# Altium schematic sheet USB-C_Serial_16U2.SchDoc: USB-C_Serial_16U2
size A4; Author: Giuseppe Pinto; CompanyName: Arduino; DrawnBy: Giuseppe Pinto; Engineer: Giuseppe Pinto; DocumentNumber: ABX_00068; Revision: V 1.0; SheetNumber: 1; SheetTotal: 1; RevAuthor: Giuseppe Pinto
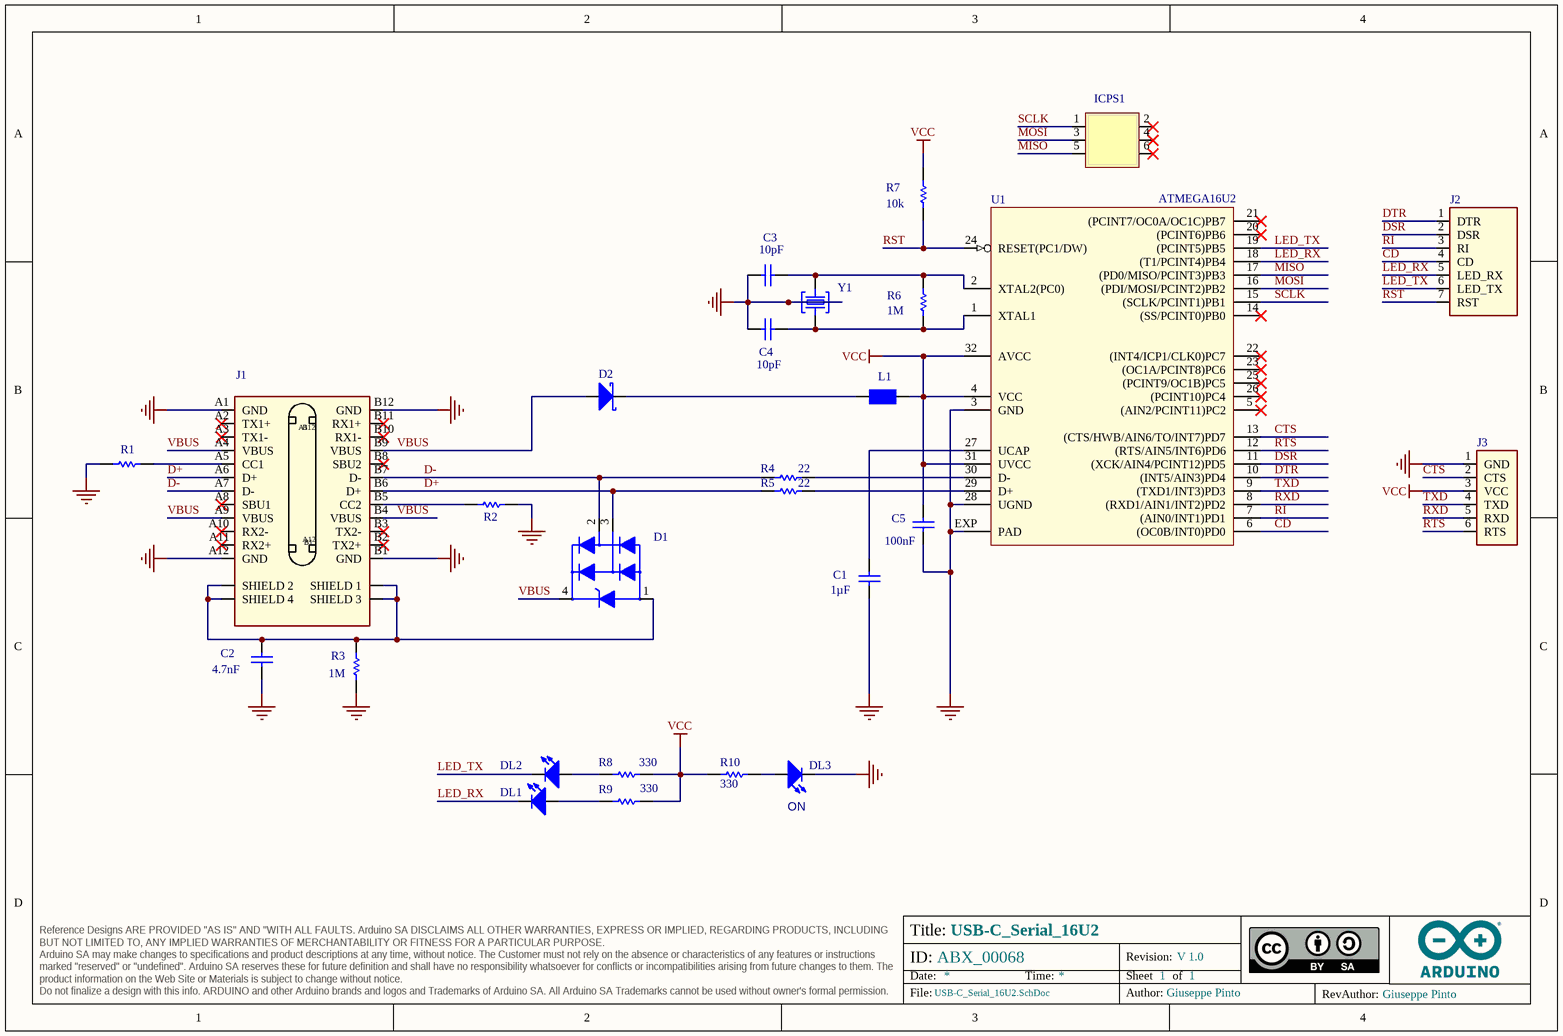
[diagram p0: USB-C_Serial_16U2.SchDoc]

## Parts
C1  value 1µF  [CAP-0402]  (hidden comment: C0402C105K8PACTU)
C2  value 4.7nF  [CAP-0805]  (hidden comment: C0805C472KDRACTU)
C3  value 10pF  [CAP-0402]  (hidden comment: C0402H100J5GACTU)
C4  value 10pF  [CAP-0402]  (hidden comment: C0402H100J5GACTU)
C5  value 100nF  [CAP-0402]  (hidden comment: C0402C104K4RACTU)
D1  PRTR5V0U2X,215  [SOT190P230X110-4N]  (value not drawn)
D2  PMEG6020AELRX  [SOD123-1]  (value not drawn)
DL1  HSMD-C190  [LEDC1608X80N-AK]  (value not drawn)
DL2  HSMD-C190  [LEDC1608X80N-AK]  (value not drawn)
DL3  HSMG-C190  [LEDC1608X80N-AK]  (value not drawn)
ICPS1  PINHD-2X03-SM-TP  [2X03-TP]  (value not drawn)  (no BOM)
J1  12401598E4#2A  [12401598E4#2A]  (value not drawn)
J2  PH1-07-UA  [CONN STRIP 2.54 PIN HEADER DIP 180° 1x 7 PIN GOLD FLASH castelleted]  (value not drawn)
J3  PH1-06-UA  [CONN STRP 2.54 PIN HEADER DIP 180° 1x X PIN GOLD FLASH]  (value not drawn)
L1  BLM18PG471SN1D  [L-0603]  (value not drawn)
R1  RC0402FR-075K1L  [RES-0402]  (value not drawn)
R2  RC0402FR-075K1L  [RES-0402]  (value not drawn)
R3  value 1M  [RES-0402]  (hidden comment: CRCW04021M00FKED)
R4  value 22  [RES-0402]  (hidden comment: CRCW040222R0JNEDC)
R5  value 22  [RES-0402]  (hidden comment: CRCW040222R0JNEDC)
R6  value 1M  [RES-0402]  (hidden comment: CRCW04021M00FKED)
R7  value 10k  [RES-0402]  (hidden comment: CRCW040210K0FKED)
R8  value 330  [RES-0402]  (hidden comment: CRCW0402330RJNED)
R9  value 330  [RES-0402]  (hidden comment: CRCW0402330RJNED)
R10  value 330  [RES-0402]  (hidden comment: CRCW0402330RJNED)
U1  ATMEGA16U2  [ATMEL_QFN32]
Y1  FTX16.000M12SM3S-30/30  [CX3225SB16000D0GZJC1-Footprint-1]  (value not drawn)

## Nets
GND: C1.2 C2.1 C3.1 C4.1 C5.1 DL3.C J1.A1(GND) J1.A12(GND) J1.B1(GND) J1.B12(GND) J3.1(GND) R1.1 R2.2 R3.1 U1.3(GND) U1.28(UGND) U1.EXP(PAD) Y1.2 Y1.4
VCC: C5.2 J3.3(VCC) L1.2 R7.2 R8.1 R9.2 R10.2 U1.4(VCC) U1.31(UVCC) U1.32(AVCC)
CD: J2.4(CD) U1.6((OC0B/INT0)PD0)
CTS: J3.2(CTS) U1.13((CTS/HWB/AIN6/TO/INT7)PD7)
D+: D1.3 J1.A6(D+) J1.B6(D+) R5.1
D-: D1.2 J1.A7(D-) J1.B7(D-) R4.1
DSR: J2.2(DSR) U1.11((XCK/AIN4/PCINT12)PD5)
DTR: J2.1(DTR) U1.10((INT5/AIN3)PD4)
LED_RX: DL1.C J2.5(LED_RX) U1.18((T1/PCINT4)PB4)
LED_TX: DL2.C J2.6(LED_TX) U1.19((PCINT5)PB5)
MISO: ICPS1.5 U1.17((PD0/MISO/PCINT3)PB3)
MOSI: ICPS1.3 U1.16((PDI/MOSI/PCINT2)PB2)
RI: J2.3(RI) U1.7((AIN0/INT1)PD1)
RST: J2.7(RST) R7.1 U1.24(RESET(PC1/DW))
RTS: J3.6(RTS) U1.12((RTS/AIN5/INT6)PD6)
RXD: J3.5(RXD) U1.8((RXD1/AIN1/INT2)PD2)
SCLK: ICPS1.1 U1.15((SCLK/PCINT1)PB1)
TXD: J3.4(TXD) U1.9((TXD1/INT3)PD3)
VBUS: D1.4 D2.A J1.A4(VBUS) J1.A9(VBUS) J1.B4(VBUS) J1.B9(VBUS)
NetC1_1: C1.1 U1.27(UCAP)
NetC2_2: C2.2 D1.1 J1.SHIELD_1 J1.SHIELD_2 J1.SHIELD_3 J1.SHIELD_4 R3.2
NetC3_2: C3.2 R6.2 U1.2(XTAL2(PC0)) Y1.3
NetC4_2: C4.2 R6.1 U1.1(XTAL1) Y1.1
NetD2_C: D2.C L1.1
NetDL1_A: DL1.A R9.1
NetDL2_A: DL2.A R8.2
NetDL3_A: DL3.A R10.1
NetJ1_A5: J1.A5(CC1) R1.2
NetJ1_B5: J1.B5(CC2) R2.1
NetR4_2: R4.2 U1.30(D-)
NetR5_2: R5.2 U1.29(D+)

Not connected (* = marked no-connect by the designer): ICPS1 2* 4* 6*; J1 A2(TX1+)* A3(TX1-)* A8(SBU1)* A10(RX2-)* A11(RX2+)* B2(TX2+)* B3(TX2-)* B8(SBU2)* B10(RX1-)* B11(RX1+)*; U1 5((AIN2/PCINT11)PC2)* 14((SS/PCINT0)PB0)* 20((PCINT6)PB6)* 21((PCINT7/OC0A/OC1C)PB7)* 22((INT4/ICP1/CLK0)PC7)* 23((OC1A/PCINT8)PC6)* 25((PCINT9/OC1B)PC5)* 26((PCINT10)PC4)*

## Notes on the sheet
- (near DL3) ON
- Title:
- ID:
- Date:
- Time:
- Revision:
- Sheet
- of
- RevAuthor:
- Reference Designs ARE PROVIDED "AS IS" AND "WITH ALL FAULTS. Arduino SA DISCLAIMS ALL OTHER WARRANTIES, EXPRESS OR IMPLIED, REGARDING PRODUCTS, INCLUDING BUT NOT LIMITED TO, ANY IMPLIED WARRANTIES OF MERCHANTABILITY OR FITNESS FOR A PARTICULAR PURPOSE.
  Arduino SA may make changes to specifications and product descriptions at any time, without notice. The Customer must not rely on the absence or characteristics of any features or instructions marked "reserved" or "undefined". Arduino SA reserves these for future definition and shall have no responsibility whatsoever for conflicts or incompatibilities arising from future changes to them. The product information on the Web Site or Materials is subject to change without notice.
  Do not finalize a design with this info. ARDUINO and other Arduino brands and logos and Trademarks of Arduino SA. All Arduino SA Trademarks cannot be used without owner's formal permission.
- File:
- Author:

## Library data of the parts
C1 = C0017-A.9: CAP CHIP 0402 1uF 10V X5R 10%; Manufacturer: KEMET; Code Arduino: 0133; Package: 0402; Case Code (Imperial): 0402; Voltage: 10V; Case Code (Metric): 1005; Manufacturer Part Number 2: GRM155R61A105KE15D; Part Number: C0402C105K8PACTU; Tolerance: 10%; Dielectric: X5R; Case/Package: 0402; Manufacturer 2: AVX
C2 = C0059-A.9: CAP CHIP 0805 4.7nF 1000V X7R 10%; Manufacturer: KEMET; Voltage: 1kV; Code Arduino: 0689; Part Number: C0805C472KDRACTU; Dielectric: X7R; Package: 0805; Case/Package: 0805; Case Code (Metric): 2012; Tolerance: 10%; Case Code (Imperial): 0805
C3 C4 = C0006-A.9: CAP CHIP 0402 10pF 50V C0G 5%; Manufacturer: KEMET; Code Arduino: 3382; Dielectric: C0G; Manufacturer Part Number 2: 04025A100KAT2A; Case Code (Imperial): 0402; Part Number: C0402H100J5GACTU; Manufacturer 2: AVX; Case Code (Metric): 1005; Voltage: 50V; Package: 0402; Case/Package: 0402; Tolerance: 5%
C5 = C0012-A.10: CAP CHIP 0402 100nF 16V X7R 10%; Manufacturer: KEMET; Code Arduino: 0132; Manufacturer Part Number 2: 0402YC104KAT2A; Voltage: 16V; Part Number: C0402C104K4RACTU; Manufacturer 2: AVX; Case/Package: 0402; Package: 0402; Tolerance: 10%; Case Code (Metric): 1005; Dielectric: X7R; Case Code (Imperial): 0402
D1 = D0025-A.3: TVS ARRAY 4LIN.8kV 1pF SOT143B; Manufacturer: Nexperia; Code Arduino: 2209; Device Type: ESD protection; Part Number: PRTR5V0U2X,215
D2 = D0026-A.3: DIODE SCHOTTKY SMD 2A 60V SOD123FL; Manufacturer: Nexperia; Code Arduino: 2208; Forward Voltage: 0.6V; RoHS Compliance: RoHS3; Part Number: PMEG6020AELRX; Device Type: Diode Schottky; Forward Current: 2A
DL1 DL2 = L0007-A.6: LED SMD 0603 ORANGE604 8mcd DIFF.; Manufacturer: Broadcom; Code Arduino: 2207; Part Number: HSMD-C190; Pin Count: 2; Manufacturer 2: Kingbright; Manufacturer Part Number 2: KPT-1608SECK
DL3 = L0009-A.4: LED SMD 0603 GREEN/568 15mcd 120^; Manufacturer: Broadcom; Code Arduino: 2204; Part Number: HSMG-C190; Pin Count: 2
ICPS1 = J0066-A.3: 2X03 6 TEST POINTS; Code Arduino: DNP; Pin Count: 6; Part Number: PINHD-2X03-SM-TP
J1 = J0220-A.5: CONN RCP USB3.1 TYPEC 24P SMD RA; Manufacturer: Amphenol ICC (Commercial Products); Code Arduino: J0220; Number of Contacts: 24; Connector Type: TELECOM AND DATACOM CONNECTOR; Termination: SMD/SMT; REACH SVHC: No SVHC; Mount: Board; Contact Material: Copper Alloy; Manufacturer Part Number 2: 12401598E4#2A; Part Number: 12401598E4#2A; Flammability Rating: UL94 V-0
J2 = J0311-A.9: CONN STRIP 2.54 PIN HEADER DIP 180° 1x 7 PIN GOLD FLASH castelleted; Manufacturer: 4 UCONN; Number of Contacts: 7; Code Arduino: J0311; Number of Conductors: 7; Pin Count: 7; Number of Rows: 1; Number of Ports: 7; Part Number: PH1-07-UA
J3 = J0310-A.3: CONN STRP 2.54 PIN HEADER DIP 180° 1x6 PIN GOLD FLASH castellated; Manufacturer: 4UCONN; Code Arduino: J0310; Number of Conductors: 6; Number of Ports: 6; Pin Count: 6; Number of Rows: 1; Part Number: PH1-06-UA; Number of Contacts: 6
L1 = I0006-A.3: FERRITE SMD 0603 470R 1A 0.2R; Manufacturer: Murata; DC Resistance (DCR): 200mR; Tolerance: 25%; Impedance: 470µH; Code Arduino: 2200; Test Frequency: 100MHz; Part Number: BLM18PG471SN1D; Min Operating Temperature: -55°C; Packaging: Tape and Reel; Max DC Current: 1A; Max Operating Temperature: 125°C; Device Type: Ferrite; Case Code (Metric): 1608; Package Quantity: 1; Current: 1A; Case Code (Imperial): 0603
R1 R2 = R0210-A.6: RES CHIP 0402 5K1 1% 1/16W; Manufacturer: YAGEO; Code Arduino: R0210; Case/Package: 0402; Tolerance: 1%; Manufacturer Part Number 2: RC0402FR-075K1L; Part Number: RC0402FR-075K1L; Manufacturer 2: YAGEO
R3 R6 = R0058-A.5: RES CHIP 0402 1M 1% 1/16W; Manufacturer: Vishay; Power: 63mW; Code Arduino: 0139; Package: 0402; Case Code (Metric): 1005; Tolerance: 1%; Manufacturer 2: Panasonic; Case Code (Imperial): 0402; Manufacturer Part Number 2: ERJ-2RKF1004X; Part Number: CRCW04021M00FKED; Case/Package: 0402
R4 R5 = R0010-A.5: RES CHIP 0402 22R 5% 1/16W; Manufacturer: Vishay; Code Arduino: 0468; Power: 63mW; Manufacturer 2: Panasonic; Part Number: CRCW040222R0JNEDC; Case/Package: 0402; Case Code (Metric): 1005; Tolerance: 5%; Package: 0402; Case Code (Imperial): 0402; Manufacturer Part Number 2: ERJ-2GEJ220X
R7 = R0003-A.8: RES CHIP 0402 10K 1% 1/16W; Manufacturer: Vishay; Power: 63mW; Code Arduino: 0136; Manufacturer Part Number 2: ERJ-2RKF1002X; Package: 0402; Case Code (Imperial): 0402; Case Code (Metric): 1005; Part Number: CRCW040210K0FKED; Tolerance: 1%; Manufacturer 2: Panasonic; Case/Package: 0402
R8 R9 = R0017-A.8: RES CHIP 0402 330R 5% 1/16W; Manufacturer: Vishay; Power: 63mW; Code Arduino: 2229; Case Code (Imperial): 0402; Part Number: CRCW0402330RJNED; Tolerance: 5%; Case Code (Metric): 1005; Package: 0402; Case/Package: 0402; Manufacturer Part Number 2: ERJ-2GEJ331X; Manufacturer 2: Panasonic
R10 = R0017-A.5: RES CHIP 0402 330R 5% 1/16W; Manufacturer: Vishay; Power: 63mW; Code Arduino: 2229; Case Code (Imperial): 0402; Part Number: CRCW0402330RJNED; Tolerance: 5%; Case Code (Metric): 1005; Package: 0402; Case/Package: 0402; Manufacturer Part Number 2: ERJ-2GEJ331X; Manufacturer 2: Panasonic
U1 = U0035-A.7: IC ATMEGA16U2; Manufacturer: Microchip; Device Type: MCU; Part Number: ATMEGA16U2; Pin Count: 33; Code Arduino: ATMEGA16U2
Y1 = X0019-A.8: CRYSTAL 16.0000MHZ 8PF SMD; Manufacturer: Fronter Electronics; Frequency: 16MHz; Code Arduino: 0395; Part Number: FTX16.000M12SM3S-30/30